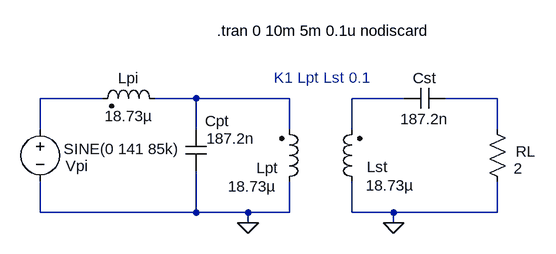
[diagram p0: schematic PLCLSSComp.asc]
PLCLSSComp.asc, the LTspice schematic file:
Version 4
SHEET 1 932 680
WIRE -32 240 -128 240
WIRE 112 240 48 240
WIRE 256 240 112 240
WIRE 432 240 352 240
WIRE 576 240 496 240
WIRE -128 288 -128 240
WIRE 112 288 112 240
WIRE 256 288 256 240
WIRE 352 288 352 240
WIRE 576 288 576 240
WIRE -128 416 -128 368
WIRE 112 416 112 352
WIRE 112 416 -128 416
WIRE 192 416 112 416
WIRE 256 416 256 368
WIRE 256 416 192 416
WIRE 352 416 352 368
WIRE 416 416 352 416
WIRE 576 416 576 368
WIRE 576 416 416 416
WIRE 192 432 192 416
WIRE 416 432 416 416
FLAG 192 432 0
FLAG 416 432 0
SYMBOL ind2 240 384 M180
WINDOW 0 -35 37 Left 2
WINDOW 3 -79 8 Left 2
SYMATTR InstName Lpt
SYMATTR Value 18.73µ
SYMATTR Type ind
SYMBOL ind2 368 384 R180
WINDOW 0 -39 38 Left 2
WINDOW 3 -80 10 Left 2
SYMATTR InstName Lst
SYMATTR Value 18.73µ
SYMATTR Type ind
SYMATTR SpiceLine Rser=0
SYMBOL res 560 272 R0
WINDOW 0 44 50 Left 2
WINDOW 3 41 76 Left 2
SYMATTR InstName RL
SYMATTR Value 2
SYMBOL cap 496 224 R90
WINDOW 0 0 32 VBottom 2
WINDOW 3 32 32 VTop 2
SYMATTR InstName Cst
SYMATTR Value 187.2n
SYMBOL cap 128 352 R180
WINDOW 0 -35 77 Left 2
WINDOW 3 -74 50 Left 2
SYMATTR InstName Cpt
SYMATTR Value 187.2n
SYMBOL voltage -128 272 R0
WINDOW 0 39 72 Left 2
WINDOW 3 36 46 Left 2
SYMATTR InstName Vpi
SYMATTR Value SINE(0 141 85k)
SYMBOL ind2 64 256 M270
WINDOW 0 32 56 VTop 2
WINDOW 3 4 56 VBottom 2
SYMATTR InstName Lpi
SYMATTR Value 18.73µ
SYMATTR Type ind
SYMATTR SpiceLine Rser=0.05
TEXT 232 208 Left 2 ;K1 Lpt Lst 0.1
TEXT 144 136 Left 2 !.tran 0 10m 5m 0.1u nodiscard

The netlist it stands for:
* PLCLSSComp.asc
Lpt 0 N002 18.73µ
Lst 0 N003 18.73µ Rser=0
RL N004 0 2
Cst N004 N003 187.2n
Cpt 0 N002 187.2n
Vpi N001 0 SINE(0 141 85k)
Lpi N002 N001 18.73µ Rser=0.05
* K1 Lpt Lst 0.1
.tran 0 10m 5m 0.1u nodiscard
.backanno
.end